# EAGLE design MazeSolverPCB_v_0.3_ (EAGLE 7.6.0)
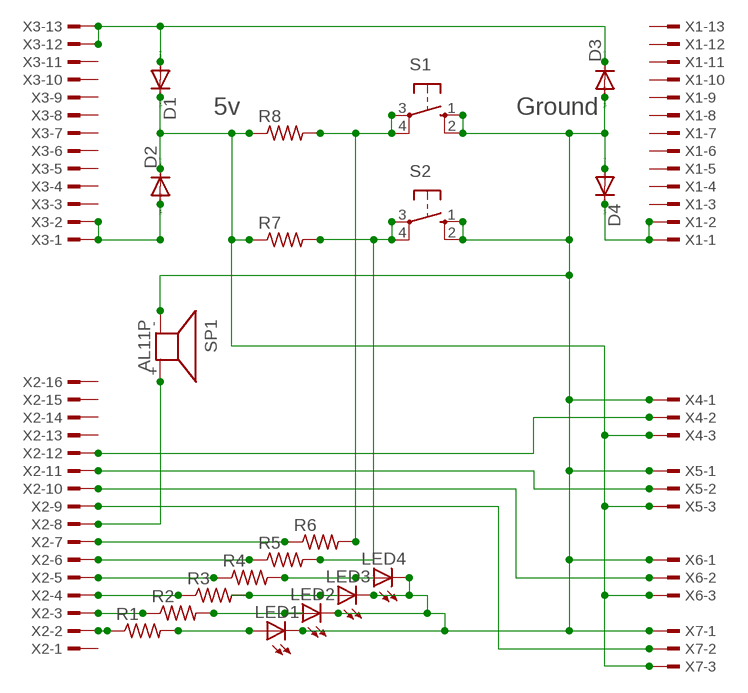
[diagram p0: schematic, sheet 1]

## Parts
D1  1N4004  [DO41-10]
D2  1N4004  [DO41-10]
D3  1N4004  [DO41-10]
D4  1N4004  [DO41-10]
LED1  TLLG4400  [LED3MM]
LED2  TLLG4400  [LED3MM]
LED3  TLLG4400  [LED3MM]
LED4  TLLG4400  [LED3MM]
R1  R-US_0207/7  [0207/7]
R2  R-US_0207/7  [0207/7]
R3  R-US_0207/7  [0207/7]
R4  R-US_0207/7  [0207/7]
R5  R-US_0207/7  [0207/7]
R6  R-US_0207/7  [0207/7]
R7  R-US_0207/7  [0207/7]
R8  R-US_0207/7  [0207/7]
S1  10-XX  [B3F-10XX]
S2  10-XX  [B3F-10XX]
SP1  AL11P  [AL11P]
X1  TSW-113-02-S-S  [TSW-113-02-S-S]
X2  TSW-116-02-S-S  [TSW-116-02-S-S]
X3  TSW-113-02-S-S  [TSW-113-02-S-S]
X4  TSW-103-02-S-S  [TSW-103-02-S-S]
X5  TSW-103-02-S-S  [TSW-103-02-S-S]
X6  TSW-103-02-S-S  [TSW-103-02-S-S]
X7  TSW-103-02-S-S  [TSW-103-02-S-S]

## Nets
N$1: D3.A D4.A LED1.K(C) LED2.K(C) LED3.K(C) LED4.K(C) S1.1(S) S1.2(S1) S2.1(S) S2.2(S1) SP1.- X4.1 X5.1 X6.1 X7.1
N$2: D1.C D2.C R7.1 R8.1 X4.3 X5.3 X6.3 X7.3
N$3: SP1.+ X2.8
N$4: X2.12 X4.2
N$5: LED1.A R1.2
N$6: R3.1 X2.4
N$7: X2.11 X5.2
N$8: D4.C X1.1 X1.2
N$9: R2.1 X2.3
N$10: R1.1 X2.2
N$11: X2.10 X6.2
N$12: R5.2 R7.2 S2.3(P) S2.4(P1)
N$13: R6.2 R8.2 S1.3(P) S1.4(P1)
N$14: X2.9 X7.2
N$15: D2.A X3.1 X3.2
N$20: D1.A D3.C X3.12 X3.13
N$25: R4.1 X2.5
N$26: R5.1 X2.6
N$27: R6.1 X2.7
N$28: LED4.A R4.2
N$29: LED3.A R3.2
N$30: LED2.A R2.2
Unconnected: X1.3 X1.4 X1.5 X1.6 X1.7 X1.8 X1.9 X1.10 X1.11 X1.12 X1.13 X2.1 X2.13 X2.14 X2.15 X2.16 X3.3 X3.4 X3.5 X3.6 X3.7 X3.8 X3.9 X3.10 X3.11

## Notes on the sheet
- 5v | Ground

## Library data of the parts
D1-D4 = aaron:1N4004: DIODE general purpose rectifier, 1 A
LED1-LED4 = led:TLLG4400: Low Current (2mA) LED 3 mm Tinted Diffused Package color GREEN Source: Data sheet <http://www.farnell.com/datasheets/391098.pdf>; MF: VISHAY SEMICONDUCTOR; OC_FARNELL: 1612435
R1-R8 = resistor:R-US_: RESISTOR, American symbol
S1 S2 = aaron:10-XX: OMRON SWITCH; MPN: B3F-1000; OC_FARNELL: 176432; OC_NEWARK: 36M3542
SP1 = ajjeffers:AL11P: SPEAKER Source: Buerklin; OC_FARNELL: unknown; OC_NEWARK: unknown
X1 X3 = aaron:TSW-113-02-S-S: THROUGH-HOLE .025" SQ POST HEADER Source: Samtec TSW.pdf; OC_FARNELL: unknown; OC_NEWARK: unknown
X2 = aaron:TSW-116-02-S-S: THROUGH-HOLE .025" SQ POST HEADER Source: Samtec TSW.pdf; OC_FARNELL: unknown; OC_NEWARK: unknown
X4-X7 = aaron:TSW-103-02-S-S: THROUGH-HOLE .025" SQ POST HEADER Source: Samtec TSW.pdf; OC_FARNELL: unknown; OC_NEWARK: unknown

## Board
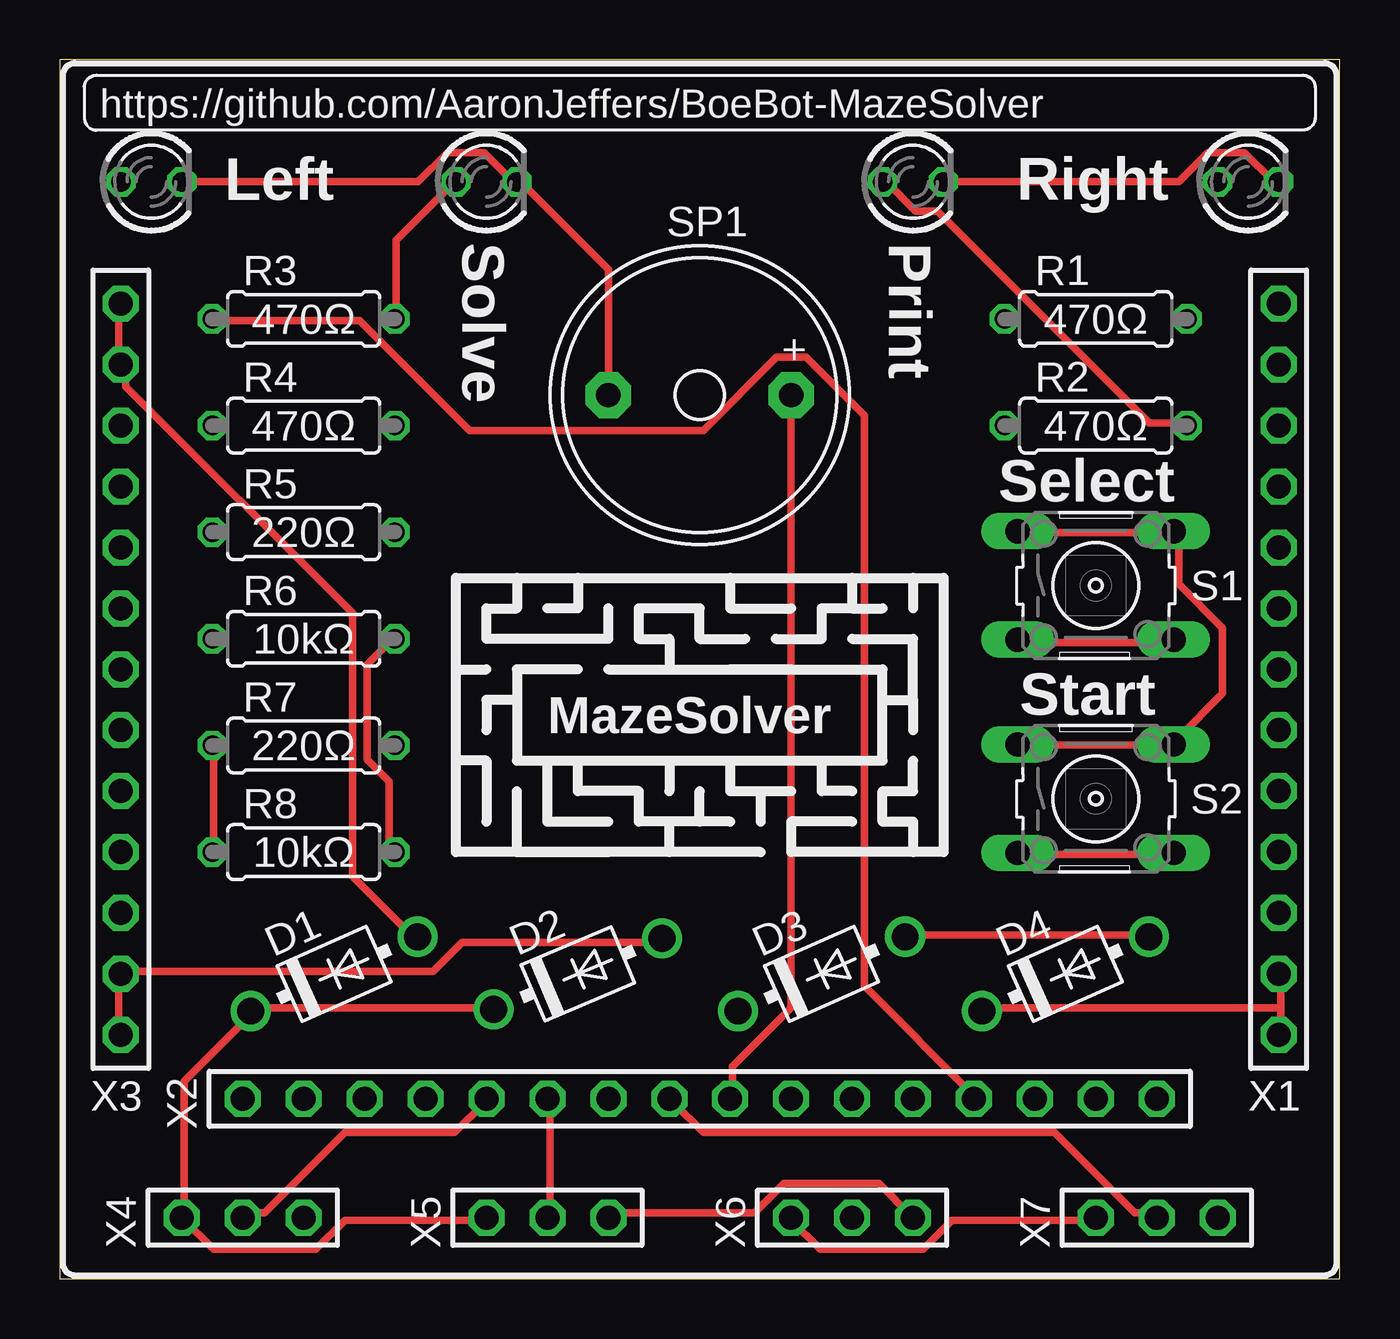
[diagram p1: board, top side]
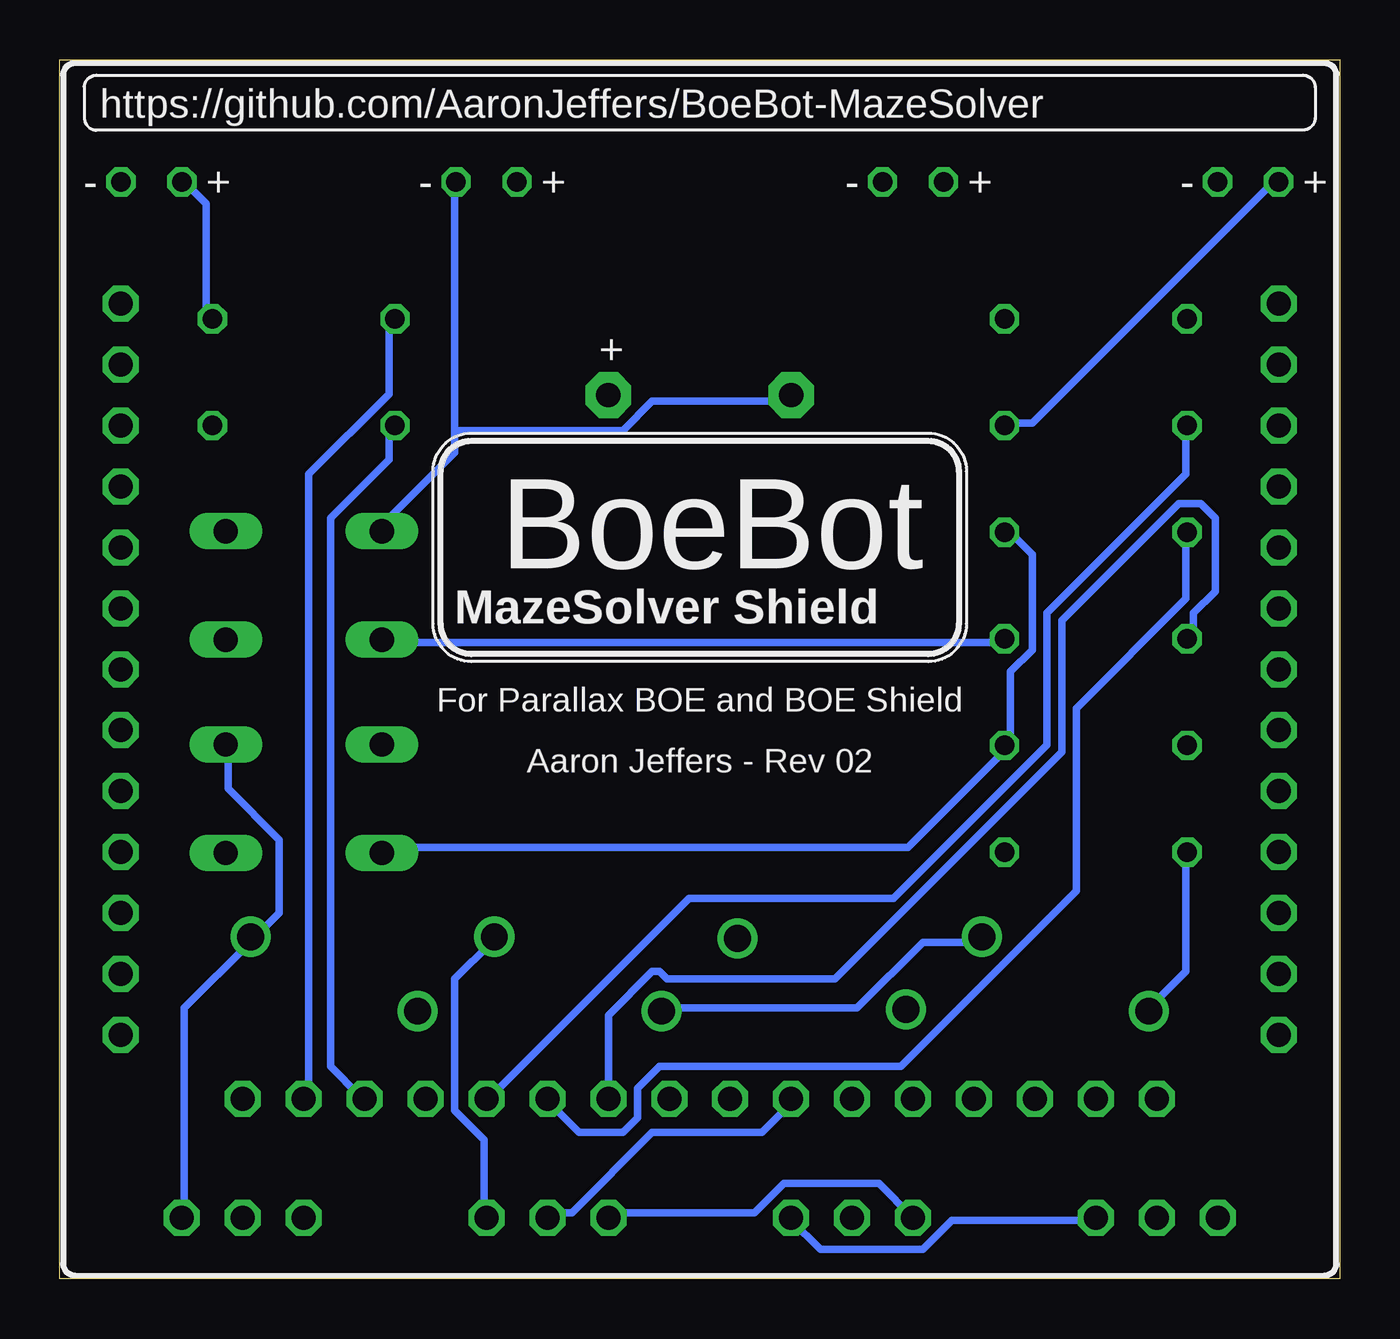
[diagram p2: board, bottom side, seen from below]

Size 53.34 x 50.8 mm. Coordinates in mm from the lower left corner, seen from the top.
Outline: 0,0 53.34,0 53.34,50.8 0,50.8 0,0
Copper layers (1*16): Top 0.0356mm / dielectric 1.5011mm / Bottom 0.0356mm
Design rules "LaenPCBOrder *": minimum track width 12mil, minimum drill 13mil, track to track 12mil, track to pad 12mil, pad to pad 12mil, via to via 12mil, smd to smd 6mil, copper to edge 15mil, drill to drill 6mil, minimum pad ring 7mil, minimum via ring 7mil, stop-mask expansion 3mil, vias tented up to drill 0mil, thermal gap 10mil

### Footprints (pad centres in the part's own frame; a part is rotated, then mirrored left to right if it is on the bottom)
DO41-10 = drill 1.118: A 3.81,0; C -3.81,0
LED3MM = drill 0.813 octagon: A -1.27,0; K 1.27,0
0207/7 = drill 0.813 octagon: 1 -3.81,0; 2 3.81,0
B3F-10XX = drill 1.016 long: 1 -3.251,2.261; 2 3.251,2.261; 3 -3.251,-2.261; 4 3.251,-2.261
AL11P = drill 1.016 pad 1.905 octagon: + 3.81,0; - -3.81,0
TSW-113-02-S-S = drill 1 pad 1.5 octagon: 1 15.24,0; 2 12.7,0; 3 10.16,0; 4 7.62,0; 5 5.08,0; 6 2.54,0; 7 0,0; 8 -2.54,0; 9 -5.08,0; 10 -7.62,0; 11 -10.16,0; 12 -12.7,0; 13 -15.24,0
TSW-116-02-S-S = drill 1 pad 1.5 octagon: 1 19.05,0; 2 16.51,0; 3 13.97,0; 4 11.43,0; 5 8.89,0; 6 6.35,0; 7 3.81,0; 8 1.27,0; 9 -1.27,0; 10 -3.81,0; 11 -6.35,0; 12 -8.89,0; 13 -11.43,0; 14 -13.97,0; 15 -16.51,0; 16 -19.05,0
TSW-103-02-S-S = drill 1 pad 1.5 octagon: 1 2.54,0; 2 0,0; 3 -2.54,0

### Placement (x,y rotation side)
D1  11.43,12.7 24 top
D2  21.59,12.7 22.9 top
D3  31.75,12.7 24 top
D4  41.91,12.7 24 top
LED1  49.53,45.72 0 top
LED2  35.56,45.72 0 top
LED3  17.78,45.72 0 top
LED4  3.81,45.72 0 top
R1  43.18,40.01 0 top
R2  43.18,35.56 0 top
R3  10.16,40.01 0 top
R4  10.16,35.56 0 top
R5  10.16,31.11 0 top
R6  10.16,26.67 0 top
R7  10.16,22.23 0 top
R8  10.16,17.78 0 top
S1  43.18,28.89 0 top
S2  43.18,20 0 top
SP1  26.67,36.83 0 top
X1  50.8,25.4 270 top
X2  26.67,7.49 0 top
X3  2.54,25.4 270 top
X4  7.62,2.54 0 top
X5  20.32,2.54 0 top
X6  33.02,2.54 0 top
X7  45.72,2.54 0 top

### Tracks (layer width: path | path; a pad name or v marks a point on that pad's centre or on a via)
N$1
  Top 0.305: LED4.K 14.94,45.72 16.15,46.94 17.68,46.94 18.9,45.72 LED3.K 19.2,45.72 22.86,42.06 SP1.- | LED2.K 46.63,45.72 47.85,46.94 49.38,46.94 50.6,45.72 LED1.K | S1.1 39.93,31.09 46.33,31.09 S1.2 46.63,31.09 46.63,28.96 48.46,27.13 48.46,24.38 46.63,22.55 S2.2 46.33,22.25 S2.1 | D3.A 35.36,14.33 45.11,14.33 D4.A | X6.1 34.14,3.96 30.18,3.96 28.96,2.74 22.86,2.74 X5.1
  Bottom 0.305: X4.1 10.36,2.44 16.15,2.44 17.37,1.22 21.64,1.22 22.86,2.44 X5.1 | X6.1 35.66,2.74 35.66,5.79 36.88,7.01 36.88,12.5 35.36,14.02 D3.A | X7.1 48.16,2.74 48.16,11.28 45.41,14.02 D4.A 45.11,14.33 44.2,15.24 44.2,18.29 46.33,20.42 46.33,22.25 S2.2 | 36.88,35.36 36.88,34.44 39.93,31.39 S1.1 | 36.88,35.36 36.88,45.72 LED2.K | 36.88,35.36 29.87,35.36 28.65,36.58 22.86,36.58 SP1.-
N$2
  Top 0.305: R8.1 6.4,17.98 6.4,21.95 R7.1 | X5.3 17.68,2.44 11.89,2.44 10.67,1.22 6.4,1.22 X4.3 5.18,2.74 5.18,8.23 7.92,10.97 D1.C 8.23,11.28 17.98,11.28 D2.C | X7.3 42.98,2.44 37.19,2.44 35.97,1.22 31.7,1.22 30.48,2.44 X6.3
  Bottom 0.305: X5.3 19.2,3.96 23.16,3.96 24.38,2.74 30.48,2.74 X6.3 | R8.1 6.4,17.68 6.4,12.8 7.92,11.28 D1.C
N$3
  Top 0.305: SP1.+ 30.48,11.28 28.04,8.84 28.04,7.62 X2.8
N$4
  Top 0.305: X4.2 7.62,2.74 8.53,2.74 11.89,6.1 16.46,6.1 17.68,7.32 X2.12
N$5
  Bottom 0.305: R1.2 47.24,40.23 47.24,44.81 48.16,45.72 LED1.A
N$6
  Top 0.305: R3.1 6.4,39.93 12.5,39.93 17.07,35.36 26.82,35.36 29.87,38.41 31.09,38.41 33.53,35.97 33.53,12.19 38.1,7.62 X2.4
N$7
  Top 0.305: X5.2 20.42,2.74 20.42,7.32 X2.11
N$8
  Top 0.305: 50.9,11.28 50.9,12.5 X1.2 | 50.9,11.28 50.9,10.36 X1.1 | 50.9,11.28 38.71,11.28 D4.C
N$9
  Bottom 0.305: R2.1 39.62,35.36 39.62,34.14 42.06,31.7 42.06,8.84 40.84,7.62 X2.3
N$10
  Bottom 0.305: R1.1 39.62,39.93 39.62,36.88 42.98,33.53 42.98,7.62 X2.2
N$11
  Bottom 0.305: X6.2 32.92,2.74 32,2.74 28.65,6.1 24.08,6.1 22.86,7.32 X2.10
N$12
  Top 0.305: S2.3 39.93,17.68 46.33,17.68 S2.4
  Bottom 0.305: R5.2 13.72,31.09 12.8,30.18 12.8,26.21 13.72,25.3 13.72,22.25 R7.2 14.02,21.95 17.98,17.98 39.93,17.98 S2.3
N$13
  Top 0.305: S1.3 39.93,26.52 46.33,26.52 S1.4 | R8.2 13.72,17.98 13.72,20.73 12.8,21.64 12.8,25.6 13.72,26.52 R6.2
  Bottom 0.305: S1.3 39.93,26.52 14.02,26.52 R6.2
N$14
  Top 0.305: X7.2 45.72,2.74 44.81,2.74 41.45,6.1 26.82,6.1 25.6,7.32 X2.9
N$15
  Top 0.305: X3.1 2.44,10.36 2.44,12.5 X3.2 2.74,12.8 15.54,12.8 16.76,14.02 24.99,14.02 D2.A
N$20
  Top 0.305: X3.13 2.44,40.54 2.44,38.1 X3.12 2.74,38.1 2.74,37.19 12.19,27.74 12.19,16.76 14.63,14.33 D1.A
  Bottom 0.305: D3.C 28.04,11.28 20.12,11.28 17.37,14.02 14.94,14.02 D1.A
N$25
  Bottom 0.305: R4.1 6.4,35.36 6.4,33.53 12.19,27.74 12.19,22.25 18.59,15.85 27.13,15.85 35.36,7.62 X2.5
N$26
  Bottom 0.305: R5.1 6.4,31.09 6.4,28.35 10.97,23.77 10.97,16.15 18.29,8.84 28.35,8.84 29.26,7.92 29.26,6.71 29.87,6.1 31.7,6.1 32.92,7.32 X2.6
N$27
  Bottom 0.305: X2.7 30.48,10.97 28.65,12.8 28.35,12.8 28.04,12.5 21.03,12.5 11.58,21.95 11.58,27.43 6.71,32.31 5.79,32.31 5.18,31.7 5.18,28.65 6.1,27.74 6.1,26.82 R6.1
N$28
  Bottom 0.305: R4.2 13.72,35.66 12.8,35.66 2.74,45.72 LED4.A
N$29
  Top 0.305: R3.2 14.02,40.23 14.02,43.28 16.46,45.72 LED3.A
N$30
  Top 0.305: R2.2 46.94,35.66 45.41,35.66 36.58,44.5 35.66,44.5 34.44,45.72 LED2.A

### Text on the board
tPlace: https://github.com/AaronJeffers/BoeBot-MazeSolver | Left | Right | Solve | Print | 470Ω | 470Ω | + | 470Ω | 470Ω | Select | 220Ω | 10kΩ | MazeSolver | Start | 220Ω | 10kΩ
bPlace: https://github.com/AaronJeffers/BoeBot-MazeSolver | + | - | + | - | + | - | + | - | + | BoeBot | MazeSolver Shield | For Parallax BOE and BOE Shield | Aaron Jeffers - Rev 02